# EasyEDA schematic 1-Schematic_GPS data logger.json
TITLE: Sheet_1; REV: 1.0; Date: 2025-04-13; Sheet: 1/1; Drawn By: kushagrakartikeye; Company: Your Company
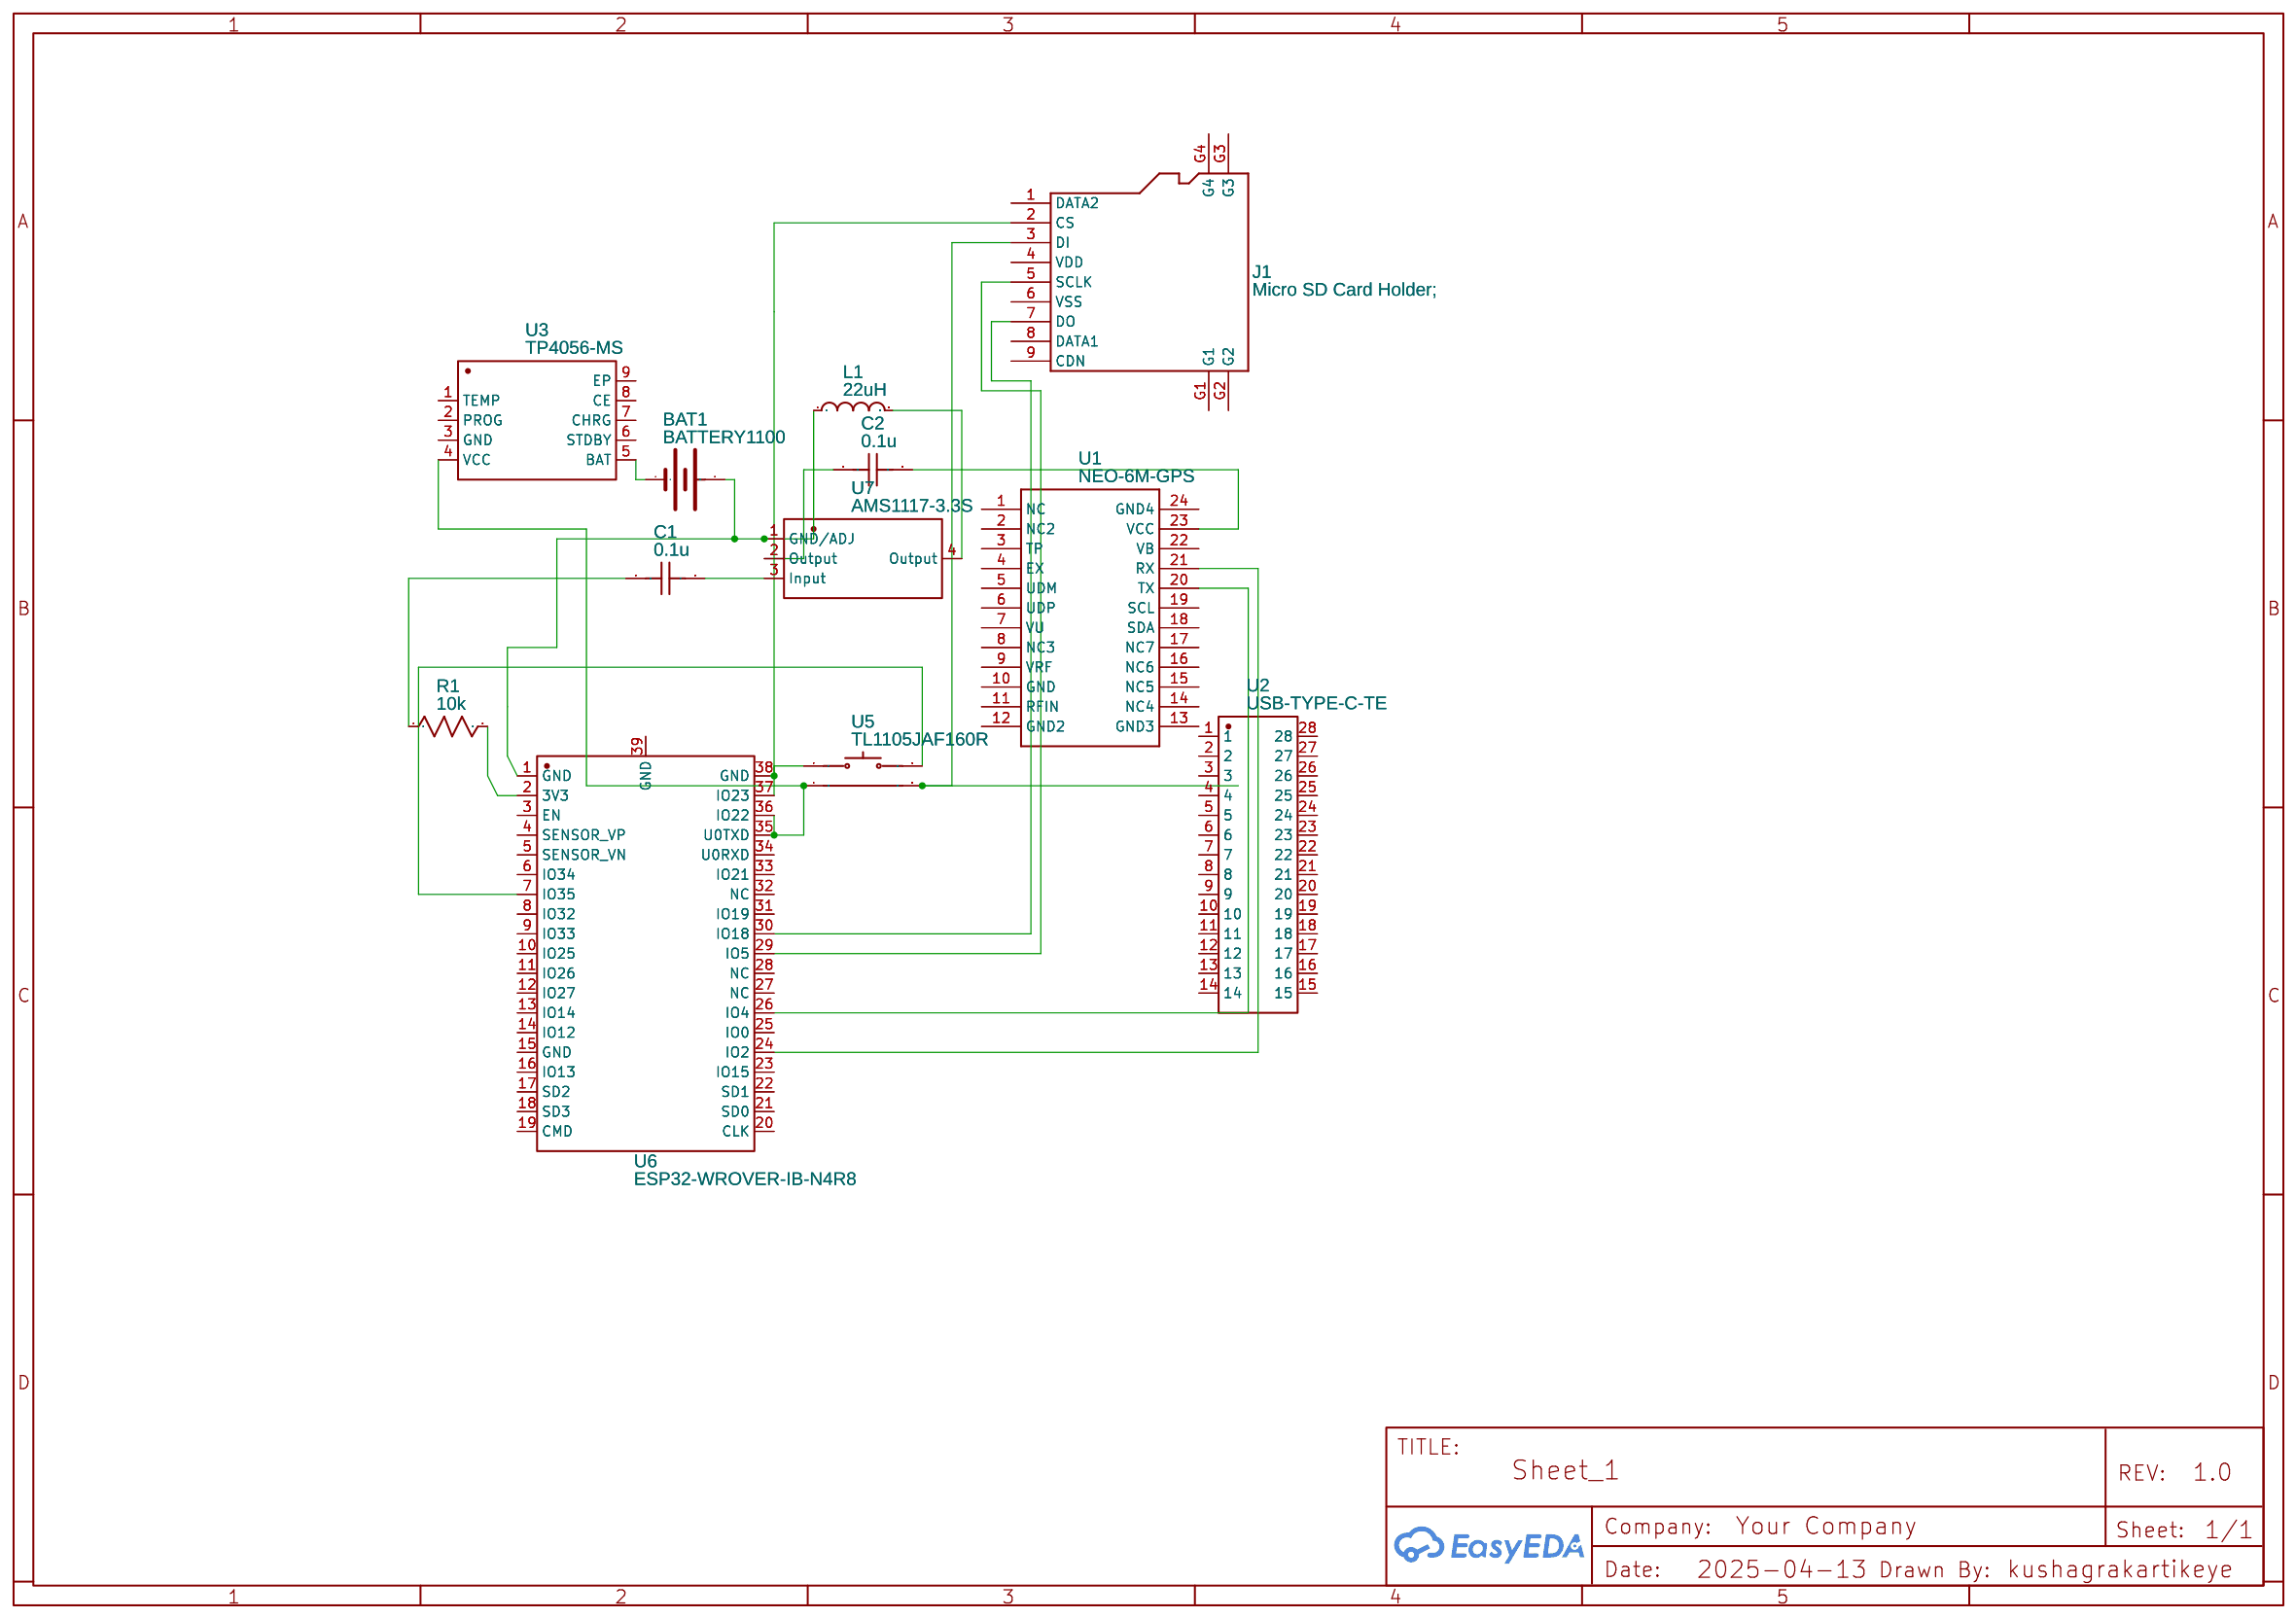
[diagram p0: schematic sheet]

## Parts
BAT1  BATTERY1100  [LIPO-1100MAH]
C1  0.1u  [C0603]
C2  0.1u  [C0603]
J1  Micro SD Card Holder;  [MICRO-SD9+4P-SMD-16.1X14.5X1.85MM]
L1  22uH  [IND-SMD_L18.5-W15.2_ASPI-1306T]
R1  10k  [R0603]
U1  NEO-6M-GPS  [GPS24P-SMD-1.1-16X12.2MM]
U2  USB-TYPE-C-TE  [USB-TYPE-C_USB-TYPE-C-TE]
U3  TP4056-MS  [SOP-8_L4.9-W3.9-P1.27-LS6.0-TL-EP]
U5  TL1105JAF160R  [KEY-TH_E-SWITCH_TL1105JAFXXXQ]
U6  ESP32-WROVER-IB-N4R8  [WIFI-SMD_ESP32-WROVER-IE8MB]
U7  AMS1117-3.3S  [SOT-223-4_L6.5-W3.5-P2.30-LS7.0-BL]

## Library data of the parts
BAT1 = BATTERY1100: Battery Holders; Contributor: SparkFun
C1 C2 = C_0603_US: Contributor: LCEDA_Lib
J1 = Micro SD Card Holder;: Manufacturer Part: ?
L1 = SSD1306-220MT: Supplier: LCSC; Supplier Part: C5127225; Manufacturer: LanTu Micro(蓝图微电); JLCPCB Part Class: Extended Part; Contributor: lcsc
R1 = R_0603_US: Contributor: LCEDA_Lib
U1 = NEO-6M-GPS: SMD GPS Module;
U2 = USB-TYPE-C-TE: Contributor: LCSC; Supplier: LCSC; Supplier Part: C9900002714; Manufacturer: null
U3 = TP4056-MS: Supplier: LCSC; Supplier Part: C7473158; Manufacturer: MSKSEMI(美森科); Contributor: lcsc; JLCPCB Part Class: Extended Part
U5 = TL1105JAF160R: Contributor: lcsc; Supplier: LCSC; Supplier Part: C4364553; Manufacturer: E-Switch
U6 = ESP32-WROVER-IB-N4R8: Supplier: LCSC; Supplier Part: C2973681; Manufacturer: ESPRESSIF(乐鑫); Contributor: lcsc; JLCPCB Part Class: Extended Part
U7 = AMS1117-3.3S: Contributor: LCSC; Supplier: LCSC; Supplier Part: C2842296; Manufacturer: KEXIN(科信); JLCPCB Part Class: Extended Part

## Nets
Net-(BAT1-+): BAT1.+ L1.1 U6.1(GND) U7.1(GND/ADJ)
Net-(BAT1--): BAT1.- U3.5(BAT)
Net-(C1-1): C1.1 R1.1
Net-(C1-2): C1.2 U7.3(Input)
Net-(C2-1): C2.1 U7.2(Output)
Net-(C2-2): C2.2 U1.23(VCC)
Net-(J1-2): J1.2(CS) U5.1 U6.37(IO23) U6.38(GND)
Net-(J1-3): J1.3(DI) U5.3
Net-(J1-5): J1.5(SCLK) U6.29(IO5)
Net-(J1-7): J1.7(DO) U6.30(IO18)
Net-(L1-2): L1.2 U7.4(Output)
Net-(R1-2): R1.2 U6.2(3V3)
Net-(U1-20): U1.20(TX) U6.26(IO4)
Net-(U1-21): U1.21(RX) U6.24(IO2)
Net-(U3-4): U3.4(VCC) U5.4 U6.35(U0TXD) U6.36(IO22)
Net-(U5-2): U5.2 U6.7(IO35)

Not connected (* = marked no-connect by the designer): J1 1(DATA2) 4(VDD) 6(VSS) 8(DATA1) 9(CDN) G1 G2 G3 G4; U1 1(NC) 2(NC2) 3(TP) 4(EX) 5(UDM) 6(UDP) 7(VU) 8(NC3) 9(VRF) 10(GND) 11(RFIN) 12(GND2) 13(GND3) 14(NC4) 15(NC5) 16(NC6) 17(NC7) 18(SDA) 19(SCL) 22(VB) 24(GND4); U2 1 2 3 4 5 6 7 8 9 10 11 12 13 14 15 16 17 18 19 20 21 22 23 24 25 26 27 28; U3 1(TEMP) 2(PROG) 3(GND) 6(STDBY) 7(CHRG) 8(CE) 9(EP); U6 3(EN) 4(SENSOR_VP) 5(SENSOR_VN) 6(IO34) 8(IO32) 9(IO33) 10(IO25) 11(IO26) 12(IO27) 13(IO14) 14(IO12) 15(GND) 16(IO13) 17(SD2) 18(SD3) 19(CMD) 20(CLK) 21(SD0) 22(SD1) 23(IO15) 25(IO0) 27(NC) 28(NC) 31(IO19) 32(NC) 33(IO21) 34(U0RXD) 39(GND)
